# Altium schematic sheet MPU.SchDoc
size A3; SheetNumber: 2; SheetTotal: 4
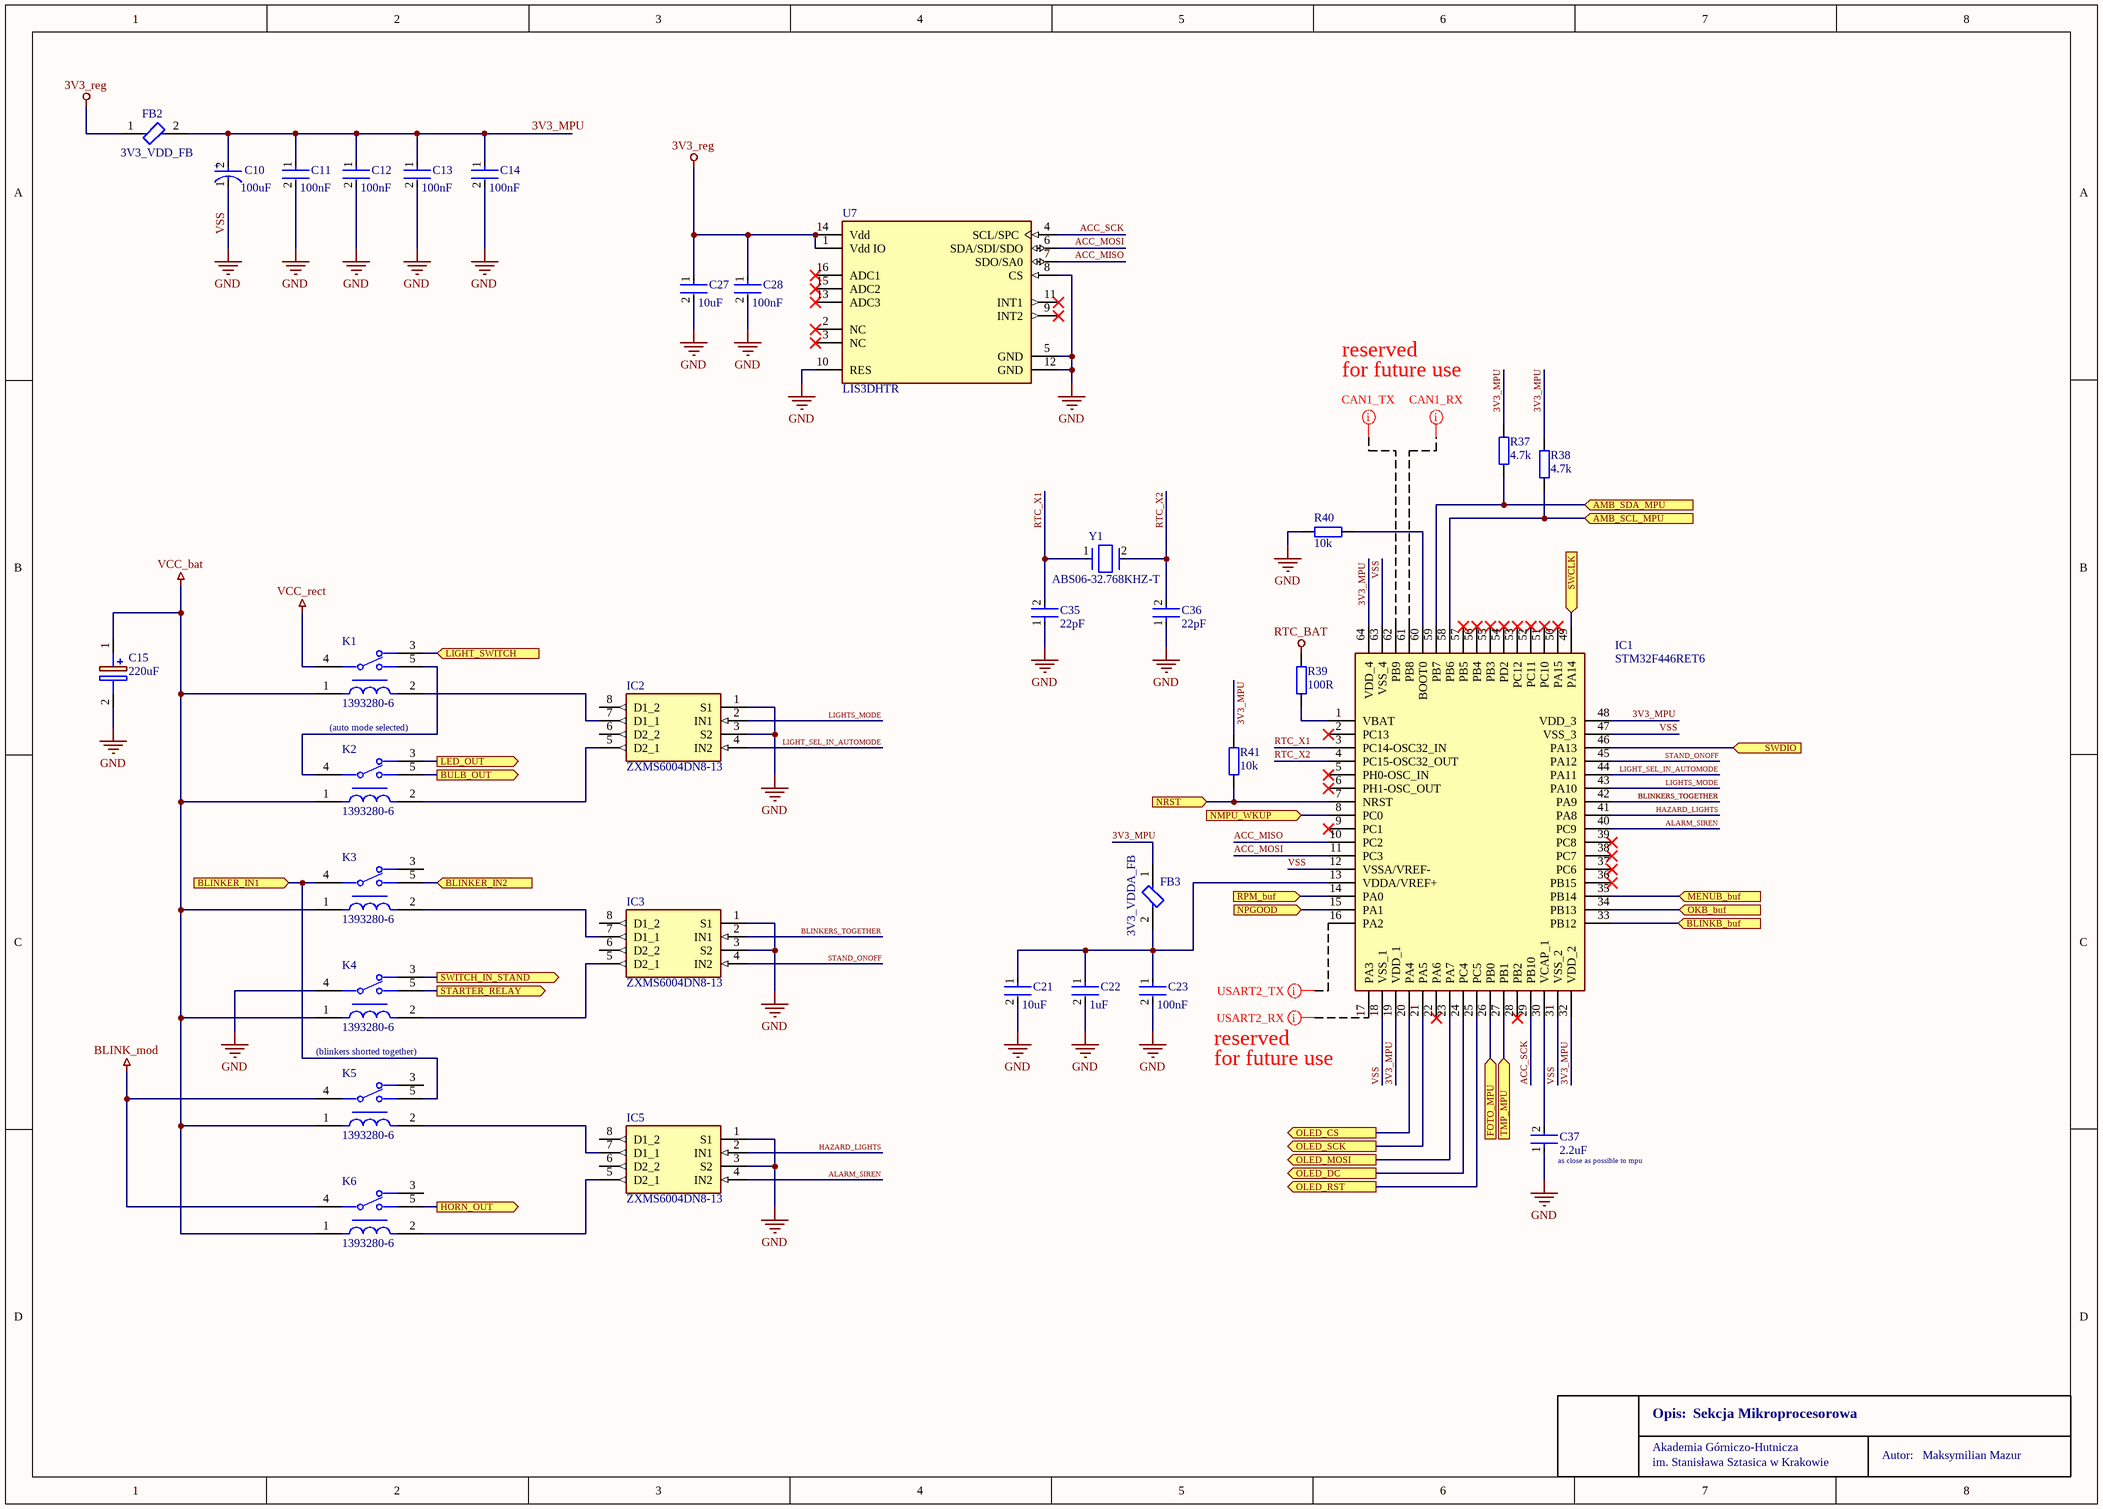
[diagram p0: MPU.SchDoc]

## Parts
C10  100uF  [FP-TAJB-MFG]
C11  100nF  [FP-CL10-IPC_A]
C12  100nF  [FP-CL10-IPC_A]
C13  100nF  [FP-CL10-IPC_A]
C14  100nF  [FP-CL10-IPC_A]
C15  220uF  [CAPAE660X810N]
C21  10uF  [FP-CL10-IPC_A]
C22  1uF  [FP-CL10-IPC_A]
C23  100nF  [FP-CL10-IPC_A]
C27  10uF  [FP-CL10-IPC_A]
C28  100nF  [FP-CL10-IPC_A]
C35  22pF  [FP-CL10-IPC_A]
C36  22pF  [FP-CL10-IPC_A]
C37  2.2uF  [FP-CL10-IPC_A]
FB2  3V3_VDD_FB  [FP-BLM18-0_15-t0_8-IPC_A]
FB3  3V3_VDDA_FB  [FP-BLM18-0_15-t0_8-IPC_A]
IC1  STM32F446RET6  [QFP50P1200X1200X160-64N]
IC2  ZXMS6004DN8-13  [SOIC127P600X175-8N]
IC3  ZXMS6004DN8-13  [SOIC127P600X175-8N]
IC5  ZXMS6004DN8-13  [SOIC127P600X175-8N]
K1  1393280-6  [FP-1393280-6-MFG]
K2  1393280-6  [FP-1393280-6-MFG]
K3  1393280-6  [FP-1393280-6-MFG]
K4  1393280-6  [FP-1393280-6-MFG]
K5  1393280-6  [FP-1393280-6-MFG]
K6  1393280-6  [FP-1393280-6-MFG]
R37  4.7k  [RES_0603]
R38  4.7k  [RES_0603]
R39  100R  [RES_0603]
R40  10k  [RES_0603]
R41  10k  [RES_0603]
U7  LIS3DHTR  [FP-LGA-16-7983231-MFG]
Y1  ABS06-32.768KHZ-T  [FP-ABS06-MFG]

## Ports
AMB_SCL_MPU (in, see Buffers[5B]), AMB_SDA_MPU (in, see Buffers[5A]), BLINKB_buf (in, see Buffers[5D]), BLINKER_IN1 (in, see Connectors[1C]), BLINKER_IN2 (in, see Connectors[1C]), BULB_OUT (out, see Connectors[3C]), FOTO_MPU (in, see Buffers[3B]), HORN_OUT (out, see Connectors[3C]), LED_OUT (out, see Connectors[2C]), LIGHT_SWITCH (in, see Connectors[1C]), MENUB_buf (in, see Buffers[5C]), NMPU_WKUP (in, see Buffers[3C], PowerSupply[5C]), NPGOOD (in, see PowerSupply[3A]), NRST (in, see Connectors[2A], Connectors[4C]), OKB_buf (in, see Buffers[5C]), OLED_CS (out, see Connectors[3B]), OLED_DC (out, see Connectors[3B]), OLED_MOSI (out, see Connectors[3B]), OLED_RST (out, see Connectors[3B]), OLED_SCK (out, see Connectors[3B]), RPM_buf (in, see Buffers[3D]), STARTER_RELAY (out, see Connectors[2D]), SWCLK (in, see Connectors[2A]), SWDIO (in, see Connectors[2B]), SWITCH_IN_STAND (out, see Connectors[1D]), TMP_MPU (in, see Buffers[3A])

## Nets
3V3_reg: C27.1 C28.1 FB2.1 U7.1(Vdd_IO) U7.14(Vdd)
BLINK_mod: K5.4 K6.4
RTC_BAT: R39.1
VCC_bat: C15.1(+) K1.1 K2.1 K3.1 K4.1 K5.1 K6.1
VCC_rect: K1.4
VSS: C10.1(C) C11.2 C12.2 C13.2 C14.2 C15.2(-) C21.2 C22.2 C23.2 C27.2 C28.2 C35.1 C36.1 C37.1 IC1.12(VSSA/VREF-) IC1.18(VSS_1) IC1.31(VSS_2) IC1.47(VSS_3) IC1.63(VSS_4) IC2.1(S1) IC2.3(S2) IC3.1(S1) IC3.3(S2) IC5.1(S1) IC5.3(S2) K4.4 R40.1 U7.5(GND) U7.8(CS) U7.10(RES) U7.12(GND)  [also labelled GND]
3V3_MPU: C10.2(A) C11.1 C12.1 C13.1 C14.1 FB2.2 FB3.1 IC1.19(VDD_1) IC1.32(VDD_2) IC1.48(VDD_3) IC1.64(VDD_4) R37.1 R38.1 R41.1
ACC_MISO: IC1.10(PC2) U7.7(SDO/SA0)
ACC_MOSI: IC1.11(PC3) U7.6(SDA/SDI/SDO)
ACC_SCK: IC1.29(PB10) U7.4(SCL/SPC)
ALARM_SIREN: IC1.40(PC9) IC5.4(IN2)
AMB_SCL_MPU: IC1.58(PB6) R38.2 ; port AMB_SCL_MPU
AMB_SDA_MPU: IC1.59(PB7) R37.2 ; port AMB_SDA_MPU
BLINKB_buf: IC1.33(PB12) ; port BLINKB_buf
BLINKER_IN1: K3.4 K5.5 ; port BLINKER_IN1
BLINKER_IN2: K3.5 ; port BLINKER_IN2
BLINKERS_TOGETHER: IC1.42(PA9) IC3.2(IN1)
BULB_OUT: K2.5 ; port BULB_OUT
FOTO_MPU: IC1.26(PB0) ; port FOTO_MPU
HAZARD_LIGHTS: IC1.41(PA8) IC5.2(IN1)
HORN_OUT: K6.5 ; port HORN_OUT
LED_OUT: K2.3 ; port LED_OUT
LIGHT_SEL_IN_AUTOMODE: IC1.44(PA11) IC2.4(IN2)
LIGHT_SWITCH: K1.3 ; port LIGHT_SWITCH
LIGHTS_MODE: IC1.43(PA10) IC2.2(IN1)
MENUB_buf: IC1.35(PB14) ; port MENUB_buf
NMPU_WKUP: IC1.8(PC0) ; port NMPU_WKUP
NPGOOD: IC1.15(PA1) ; port NPGOOD
NRST: IC1.7(NRST) R41.2 ; port NRST
OKB_buf: IC1.34(PB13) ; port OKB_buf
OLED_CS: IC1.20(PA4) ; port OLED_CS
OLED_DC: IC1.24(PC4) ; port OLED_DC
OLED_MOSI: IC1.23(PA7) ; port OLED_MOSI
OLED_RST: IC1.25(PC5) ; port OLED_RST
OLED_SCK: IC1.21(PA5) ; port OLED_SCK
RPM_buf: IC1.14(PA0) ; port RPM_buf
RTC_X1: C35.2 IC1.3(PC14-OSC32_IN) Y1.1
RTC_X2: C36.2 IC1.4(PC15-OSC32_OUT) Y1.2
STAND_ONOFF: IC1.45(PA12) IC3.4(IN2)
STARTER_RELAY: K4.5 ; port STARTER_RELAY
SWCLK: IC1.49(PA14) ; port SWCLK
SWDIO: IC1.46(PA13) ; port SWDIO
SWITCH_IN_STAND: K4.3 ; port SWITCH_IN_STAND
TMP_MPU: IC1.27(PB1) ; port TMP_MPU
NetC21_1: C21.1 C22.1 C23.1 FB3.2 IC1.13(VDDA/VREF+)
NetC37_2: C37.2 IC1.30(VCAP_1)
NetIC1_1: IC1.1(VBAT) R39.2
NetIC1_60: IC1.60(BOOT0) R40.2
NetIC2_5: IC2.5(D2_1) K2.2
NetIC2_7: IC2.7(D1_1) K1.2
NetIC3_5: IC3.5(D2_1) K4.2
NetIC3_7: IC3.7(D1_1) K3.2
NetIC5_5: IC5.5(D2_1) K6.2
NetIC5_7: IC5.7(D1_1) K5.2
NetK1_5: K1.5 K2.4

Not connected (* = marked no-connect by the designer): IC1 2(PC13)* 5(PH0-OSC_IN)* 6(PH1-OSC_OUT)* 9(PC1)* 16(PA2) 17(PA3) 22(PA6)* 28(PB2)* 36(PB15)* 37(PC6)* 38(PC7)* 39(PC8)* 50(PA15)* 51(PC10)* 52(PC11)* 53(PC12)* 54(PD2)* 55(PB3)* 56(PB4)* 57(PB5)* 61(PB8) 62(PB9); IC2 6(D2_2) 8(D1_2); IC3 6(D2_2) 8(D1_2); IC5 6(D2_2) 8(D1_2); K3 3; K5 3; K6 3; U7 2(NC)* 3(NC)* 9(INT2)* 11(INT1)* 13(ADC3)* 15(ADC2)* 16(ADC1)*

## Layout directives
mark named CAN1_TX: (no net found under the mark)
mark named CAN1_RX: (no net found under the mark)
mark named USART2_TX: (no net found under the mark)
mark named USART2_RX: (no net found under the mark)

## Notes on the sheet
- reserved
- for future use
- (auto mode selected)
- (blinkers shorted together)
- (near C37) as close as possible to mpu
- Akademia Górniczo-Hutnicza
- Opis:
- Sekcja Mikroprocesorowa
- Autor:
- Maksymilian Mazur
- im. Stanisława Sztasica w Krakowie
- (in symbol CMP-04424-000366-1) +

## Library data of the parts
C10 = CMP-04424-000366-1: 100uF 6.3V  ±10% 1.7Ω 1210  SMD Tantalum Capacitor / TAJB107K006RNJ; ESR (Equivalent Series Resistance): 1.7R; Polarity: Polar; Leakage Current: 6.3uA; Height: 1.9mm; Depth: 2.8mm; Length: 3.5mm; Min Operating Temperature: -55°C; Voltage Rating (DC): 6.3V; Width: 2.8mm; Series: TAJ; Lead Free: Lead Free; Case/Package: 1210; Voltage: 6.3V; Mount: Surface Mount; Tolerance: 10%; Capacitance: 100uF; Radiation Hardening: No; REACH SVHC: No SVHC; Voltage Rating: 6.3V; Case Code (Metric): 3528; Dissipation Factor: 10%; Packaging: Tape and Reel; Construction: Flat; Features: General Purpose; Max Operating Temperature: 125°C; RoHS Compliant: Yes; Package Quantity: 1; Dielectric Material: Tantalum; Termination: SMD/SMT; Case Code (Imperial): 1210; Height - Seated (Max): 0.083inch
C11-C14 C23 C28 = CMP-13271-000587-1: Cap Ceramic 100nF 10V X7R ±10% Pad SMD 0603 +125°C T/R; Voltage Rating: 50V; Case/Package: 0603; Depth: 0.8mm; Max Operating Temperature: 125°C; Lead Free: Lead Free; Material: Ceramic; Min Operating Temperature: -55°C; Voltage Rating (DC): 50V; Dielectric: X7R; Height: 0.8mm; Capacitance: 100nF; Thickness: 0.035inch; Radiation Hardening: No; Voltage: 50V; Packaging: Tape and Reel; Length: 1.6mm; Tolerance: 10%; Width: 0.031inch; Mount: Surface Mount; Package Quantity: 10000
C15 = SC1C227M6L07KVR: Capacitor Polarised / 220uF 16V / SC1C227M6L07KVR; Manufacturer_Name: SAMWHA; Datasheet Link: https://octopart.com/datasheet/sc1c227m6l07kvr-samwha-30812620; Height: 8.1mm; Manufacturer_Part_Number: SC1C227M6L07KVR
C21 C27 = CMP-13271-000587-1: Cap Ceramic 10uF 10V X7R ±10% Pad SMD 0603 +125°C T/R; Voltage Rating: 50V; Capacitance: 100nF; Case/Package: 0603; Depth: 0.8mm; Max Operating Temperature: 125°C; Lead Free: Lead Free; Material: Ceramic; Min Operating Temperature: -55°C; Voltage Rating (DC): 50V; Dielectric: X7R; Height: 0.8mm; Thickness: 0.035inch; Radiation Hardening: No; Voltage: 50V; Packaging: Tape and Reel; Length: 1.6mm; Tolerance: 10%; Width: 0.031inch; Mount: Surface Mount; Package Quantity: 10000
C22 = CMP-13271-000587-1: Cap Ceramic 1uF 10V X7R ±10% Pad SMD 0603 +125°C T/R; Voltage Rating: 50V; Capacitance: 100nF; Case/Package: 0603; Depth: 0.8mm; Max Operating Temperature: 125°C; Lead Free: Lead Free; Material: Ceramic; Min Operating Temperature: -55°C; Voltage Rating (DC): 50V; Dielectric: X7R; Height: 0.8mm; Thickness: 0.035inch; Radiation Hardening: No; Voltage: 50V; Packaging: Tape and Reel; Length: 1.6mm; Tolerance: 10%; Width: 0.031inch; Mount: Surface Mount; Package Quantity: 10000
C35 C36 = CMP-13271-000587-1: Cap Ceramic 22pF 25V SMD 0603; Voltage Rating: 50V; Dielectric: X7R; Tolerance: 10%; Case/Package: 0603; Depth: 0.8mm; Max Operating Temperature: 125°C; Lead Free: Lead Free; Material: Ceramic; Min Operating Temperature: -55°C; Voltage Rating (DC): 50V; Height: 0.8mm; Capacitance: 22pF; Thickness: 0.035inch; Radiation Hardening: No; Voltage: 50V; Packaging: Tape and Reel; Length: 1.6mm; Width: 0.031inch; Mount: Surface Mount; Package Quantity: 10000
C37 = CMP-13271-000587-1: Cap Ceramic 2.2uF / SMD 0603; Voltage Rating: 50V; Dielectric: X7R; Capacitance: 22pF; Tolerance: 10%; Case/Package: 0603; Depth: 0.8mm; Max Operating Temperature: 125°C; Lead Free: Lead Free; Material: Ceramic; Min Operating Temperature: -55°C; Voltage Rating (DC): 50V; Height: 0.8mm; Thickness: 0.035inch; Radiation Hardening: No; Voltage: 50V; Packaging: Tape and Reel; Length: 1.6mm; Width: 0.031inch; Mount: Surface Mount; Package Quantity: 10000
FB2 FB3 = CMP-0686-00557-7: Chip Ferrite Bead, 0603 / Z = 220, f = 100MHz; Impedance: 120R; Number of Circuits: 1; Max Current Rating: 2A; Shielding: Unshielded; Material: Steel; DC Resistance (DCR): 50mR; Tolerance: 25%; Case Code (Imperial): 0603; RoHS Compliant: Yes; Number of Pins: 2; Min Operating Temperature: -55°C; Case Code (Metric): 1608; Frequency: 100MHz; Length: 1.6mm; Test Frequency: 100MHz; Max Operating Temperature: 125°C; Packaging: Tape and Reel; Termination: SMD/SMT; Lead Free: Lead Free; Max DC Current: 2A; Case/Package: 0603; Height: 0.8mm; Current Rating: 2A; Radiation Hardening: No; Core Material: Ferrite; DC Current: 2A; REACH SVHC: No SVHC; Package Quantity: 1; Depth: 0.8mm; Number of Lines: 1; Width: 0.8mm
IC1 = STM32F446RET6: Integrated Circuit; Manufacturer_Name: STMicroelectronics; Datasheet Link: https://datasheet.datasheetarchive.com/originals/distributors/DKDS41/DSANUWW0028583.pdf; Height: 1.6mm; Manufacturer_Part_Number: STM32F446RET6; Mouser Part Number: 511-STM32F446RET6; Mouser Price/Stock: https://www.mouser.co.uk/ProductDetail/STMicroelectronics/STM32F446RET6?qs=Ok1pvOkw6%2FqpQsWf8F4wtQ%3D%3D; Arrow Part Number: STM32F446RET6; Arrow Price/Stock: https://www.arrow.com/en/products/stm32f446ret6/stmicroelectronics?utm_currency=USD&region=nac
IC2 IC3 IC5 = ZXMS6004DN8-13: Integrated Circuit; Manufacturer_Name: Diodes Incorporated; Datasheet Link: https://www.diodes.com//assets/Datasheets/ZXMS6004DN8.pdf; Height: 1.75mm; Manufacturer_Part_Number: ZXMS6004DN8-13; Mouser Part Number: 621-ZXMS6004DN8-13; Mouser Price/Stock: https://www.mouser.co.uk/ProductDetail/Diodes-Incorporated/ZXMS6004DN8-13?qs=W66WzN12R3YH%252BpRyFoT8Rg%3D%3D; Arrow Part Number: ZXMS6004DN8-13; Arrow Price/Stock: https://www.arrow.com/en/products/zxms6004dn8-13/diodes-incorporated?region=nac
K1-K6 = CMP-03395-000123-1: Electromechanical Relay 12VDC 254Ohm 40A SPDT (12.9x12x9.9)mm THT Power Relay; Manufacturer: TE Connectivity; Coil Voltage: 12V; Number Of Contacts: 1; Coil Resistance: 254Ω; Coil Type: Non-Latching; Standoff Height: 0.3mm; Current Rating: 30A; Coil Power: 567mW; Ambient Temperature Range Low: -40°C; Device Class L2: Relays; ComponentLink2URL: https://www.te.com/commerce/DocumentDelivery/DDEController?Action=showdoc&DocId=Data+Sheet%7FV23086-X0000-A001%7F0717%7Fpdf%7FEnglish%7FENG_DS_V23086-X0000-A001_0717.pdf%7F1393280-6; Device Class L1: Electromechanical; ComponentLink2Description: Datasheet; Lead Free: Yes; Package: 1393280-6; Manufacturer Part Number: 1393280-6; Device Class L3: Power Relays; RoHS: TRUE; Footprint Url: https://www.te.com/commerce/DocumentDelivery/DDEController?Action=showdoc&DocId=Customer+Drawing%7FV23086-C1001-A403%7FE%7Fpdf%7FEnglish%7FENG_CD_V23086-C1001-A403_E.pdf%7F1393280-6; Octopart: https://octopart.com/1393280-6-te+connectivity-45289632; Automotive: No; Category: Relay; Throw Configuration: SPDT; Ambient Temperature Range High: +105°C; Height: 10.1mm
R37-R41 = RES_0603: Resistor SMD 0603; Manufacturer: *; Manufacturer Part Number: *; Distributor Link: *; LCSC: *
U7 = CMP-0234-00055-6: ACCEL 2-16G I2C/SPI 16LGA; Max Supply Voltage: 3.6V; Bandwidth: 5kHz; Min Supply Voltage (DC): 1.71V; Interface: I2C; Axis: X, Y, Z; Operating Supply Voltage: 2.5V; Operating Supply Current: 11uA; Output Type: Digital; Resolution: 16b; Sensor Type: 3 Axis; Series: -; Package Quantity: 1; Case/Package: LGA; Radiation Hardening: No; Min Operating Temperature: -40°C; Length: 3mm; Max Supply Voltage (DC): 3.6V; Lead Free: Lead Free; Height: 1mm; Number of Pins: 16; RoHS Compliant: Yes; Packaging: Tape and Reel; Width: 3mm; Contact Plating: Gold; Max Operating Temperature: 85°C; Min Supply Voltage: 1.71V; REACH SVHC: No SVHC; Depth: 3mm
Y1 = CMP-2000-05035-2: Crystal 32.768kHz ±20ppm (Tol) 12.5pF FUND 90kΩ 2-Pin Mini-CSMD T/R; Insulation Resistance: 500MR; ESR (Equivalent Series Resistance): 90kR; REACH SVHC: No SVHC; Mount: Surface Mount; Min Operating Temperature: -40°C; Packaging: Tape and Reel; Max Operating Temperature: 85°C; Frequency Stability: 20ppm; Length: 2mm; Lead Free: Lead Free; Termination: SMD/SMT; Width: 1.2mm; RoHS Compliant: Yes; Load Capacitance: 12.5pF; Depth: 1.2mm; Frequency: 32.768kHz; Package Quantity: 3000; Tolerance: 20ppm; Radiation Hardening: No; Series: ABS06; Frequency Tolerance: 20ppm; Number of Pins: 2; Operating Frequency: 32.768 kHz; Series Resistance: 90kR; Height: 0.6mm; Case/Package: CSMD